# Altium schematic sheet CLKB_power_regulators.SchDoc
size A4
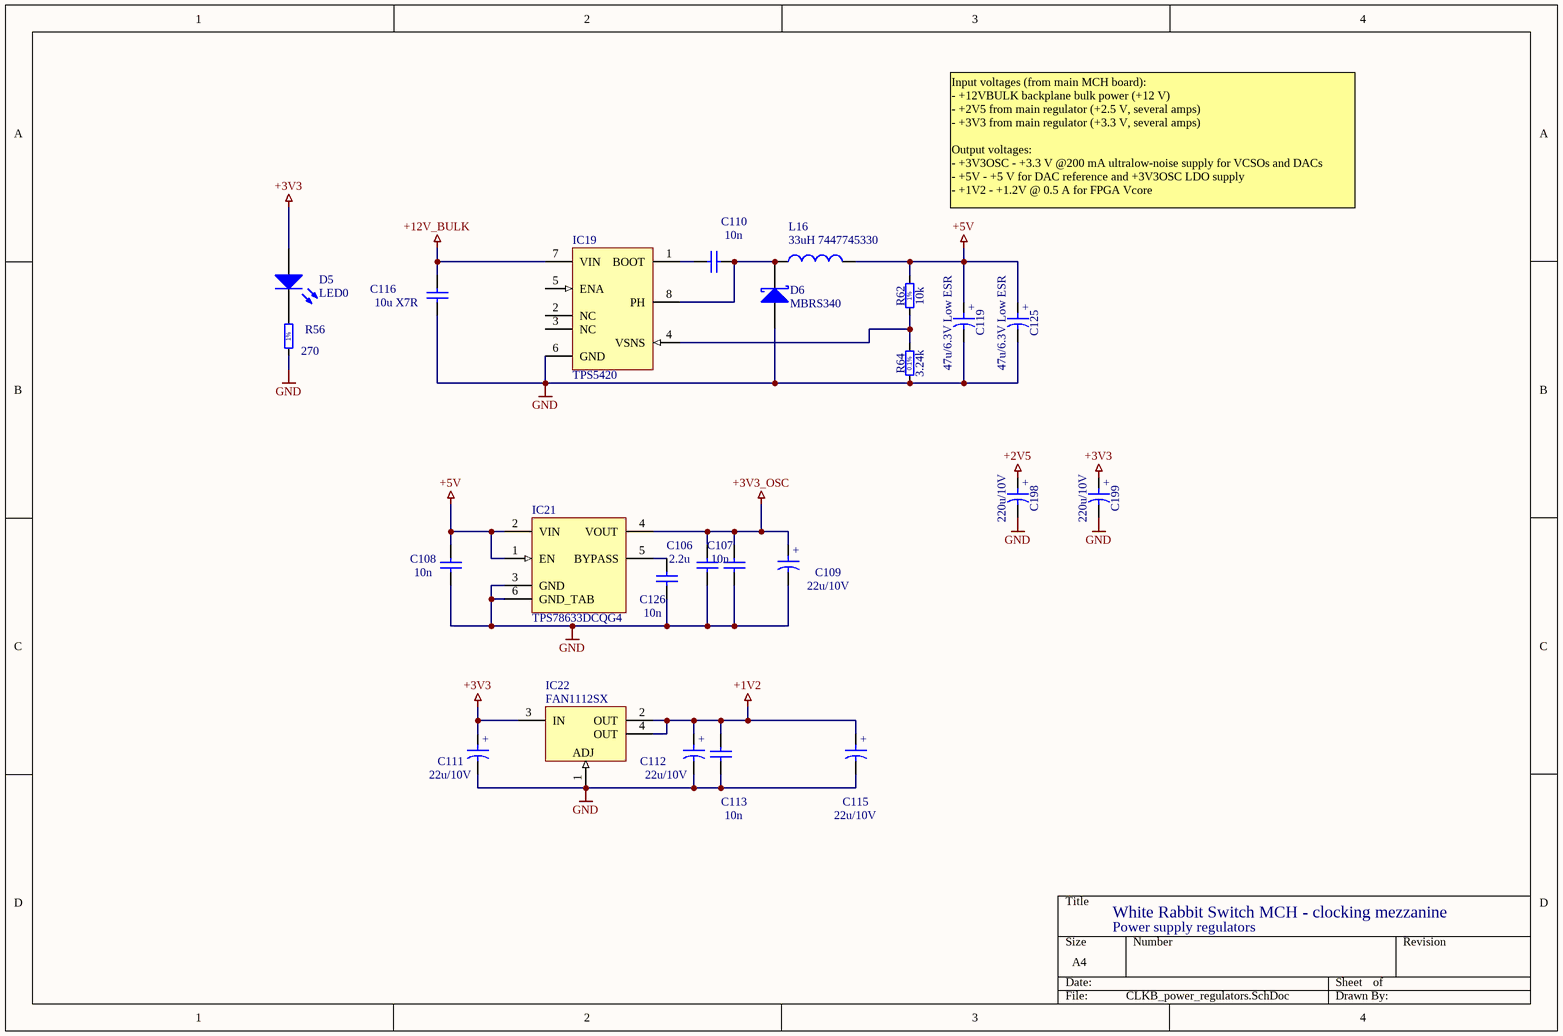
[diagram p0: CLKB_power_regulators.SchDoc]

## Parts
C106  2.2u  [CAPC2012X135N]
C107  10n  [CAPC1608X87N]
C108  10n  [CAPC1608X87N]
C109  22u/10V  [CAPMP3216X180N]
C110  10n  [CAPC1608X87N]
C111  22u/10V  [CAPMP3216X180N]
C112  10n  [CAPC1608X87N]
C113  22u/10V  [CAPMP3216X180N]
C115  22u/10V  [CAPMP3216X180N]
C116  10u X7R  [CAPC3216X140N]
C119  47u/6.3V Low ESR  [CAPMP3528X210N]
C125  47u/6.3V Low ESR  [CAPMP3528X210N]
C126  10n  [CAPC1608X87N]
C198  220u/10V  [CAPMP7343X430N]
C199  220u/10V  [CAPMP7343X430N]
D5  LED0  [CD1608-0603]
D6  MBRS340  [SMB]
IC19  TPS5420  [SOIC127P600-8AL]
IC21  value TPS78633DCQG4  [SOT223-6L]  (hidden comment: TPS78633)
IC22  FAN1112SX  [SOT223-4L]
L16  33uH 7447745330  [L_VLCF5020]
R56  270  [RESC1608X55N]
R62  10k  [RESC1608X55N]
R64  3.24k  [RESC1608X55N]

## Nets
+1V2: C112.2 C113.1 C115.1 IC22.2(OUT) IC22.4(OUT)
+2V5: C198.1
+3V3: C111.1 C199.1 D5.1(A) IC22.3(IN)
+3V3_OSC: C106.2 C107.2 C109.1 IC21.4(VOUT)
+5V: C108.2 C119.1 C125.1 IC21.1(EN) IC21.2(VIN) L16.2 R62.2
+12V_BULK: C116.2 IC19.7(VIN)
GND: C106.1 C107.1 C108.1 C109.2 C111.2 C112.1 C113.2 C115.2 C116.1 C119.2 C125.2 C126.1 C198.2 C199.2 D6.1(A) IC19.6(GND) IC21.3(GND) IC21.6(GND_TAB) IC22.1(ADJ) R56.1 R64.1
NetC110_1: C110.1 D6.2(K) IC19.8(PH) L16.1
NetC110_2: C110.2 IC19.1(BOOT)
NetC126_2: C126.2 IC21.5(BYPASS)
NetD5_2: D5.2(K) R56.2
NetIC19_4: IC19.4(VSNS) R62.1 R64.2

Not connected (* = marked no-connect by the designer): IC19 2(NC) 3(NC) 5(ENA)

## Notes on the sheet
- Input voltages (from main MCH board):
  - +12VBULK backplane bulk power (+12 V)
  - +2V5 from main regulator (+2.5 V, several amps)
  - +3V3 from main regulator (+3.3 V, several amps)
  Output voltages:
  - +3V3OSC - +3.3 V @200 mA ultralow-noise supply for VCSOs and DACs
  - +5V - +5 V for DAC reference and +3V3OSC LDO supply
  - +1V2 - +1.2V @ 0.5 A for FPGA Vcore
- White Rabbit Switch MCH - clocking mezzanine
- Power supply regulators
- (in symbol CTE3216-18_22UF_10V_10%) +
- (in symbol CTE3528-21_47UF_6.3V_10%_LESR0250) +
- (in symbol CTE7343-43_220UF_10V_10%_LESR0050) +
- (in symbol R0603_3K24_0.1%_0.063W_10PPM) 0.1%
- (in symbol R0603_10K_1%_0.1W_100PPM) 1%
- (in symbol R0603_270R_1%_0.1W_100PPM) 1%

## Library data of the parts
C106 = CC0805_2.2UF_16V_10%_X7R: Non-polarised capacitor; Part Description: SMD Multilayer Chip Ceramic Capacitor; Manufacturer: GENERIC; Manufacturer1 Part Number: GRM21BF51C225ZA01L; Manufacturer1 Datasheet: \\cern.ch\dfs\Applications\Altium\Datasheets\CC0805_X7R_KEMET.pdf; Value: 2.2uF; Voltage: 16V; TC: X7R; Tolerance: ±10%; Table: Capacitors SMD; Part Number: CC0805_2.2UF_16V_10%_X7R; Component Kind: Standard; Component Type: Standard; Designator: Capacitor - non polarized; Library Reference: Capacitor - non polarized; Pin Count: 2; Status: Preferred; Manufacturer Part Number: CC0805_2.2UF_16V_10%_X7R; Case: 0805; Mounted: Yes; Socket: No; SMD: Yes; Manufacturer1 Example: MURATA; Manufacturer1 ComponentHeight: 1.5mm; HelpURL: \\cern.ch\dfs\Applications\Altium\Datasheets\CC0805_X7R_KEMET.pdf; Author: CERN DEM JLC; CreateDate: 12/3/2007; LatestRevisionDate: 12/3/2007
C107 C108 C110 C112 C126 = CC0603_10NF_50V_10%_X7R: Non-polarised capacitor; Part Description: SMD Multilayer Chip Ceramic Capacitor; Manufacturer: GENERIC; Manufacturer1 Part Number: 223858615636; Manufacturer1 Datasheet: \\cern.ch\dfs\Applications\Altium\Datasheets\CC0603_X7R_PHYCOMP.pdf; Value: 10nF; Voltage: 50V; TC: X7R; Tolerance: ±10%; Table: Capacitors SMD; Part Number: CC0603_10NF_50V_10%_X7R; Component Kind: Standard; Component Type: Standard; Designator: Capacitor - non polarized; Library Reference: Capacitor - non polarized; Pin Count: 2; Status: Preferred; Manufacturer Part Number: CC0603_10NF_50V_10%_X7R; Case: 0603; Mounted: Yes; Socket: No; SMD: Yes; Manufacturer1 Example: PHYCOMP; Manufacturer1 ComponentHeight: 0.87mm; HelpURL: \\cern.ch\dfs\Applications\Altium\Datasheets\CC0603_X7R_PHYCOMP.pdf; Author: CERN DEM JLC; CreateDate: 12/3/2007; LatestRevisionDate: 12/3/2007
C109 C111 C113 C115 = CTE3216-18_22UF_10V_10%: Polarised capacitor; Part Description: Solid Tantalum Chip Capacitor; Manufacturer: GENERIC; Manufacturer1 Part Number: TAJA226K010R; Manufacturer1 Datasheet: \\cern.ch\dfs\Applications\Altium\Datasheets\CTE_AVX_TAJ.pdf; Value: 22uF; Voltage: 10V; Tolerance: ±10%; Table: Capacitors SMD; Part Number: CTE3216-18_22UF_10V_10%; Component Kind: Standard; Component Type: Standard; Designator: Capacitor - polarized; Library Reference: Capacitor - polarized; Pin Count: 2; Status: Preferred; Manufacturer Part Number: CTE3216-18_22UF_10V_10%; Case: A; Mounted: Yes; Socket: No; SMD: Yes; Manufacturer1 Example: AVX; Manufacturer1 ComponentHeight: 1.8mm; HelpURL: \\cern.ch\dfs\Applications\Altium\Datasheets\CTE_AVX_TAJ.pdf; Author: CERN DEM JLC; CreateDate: 12/3/2007; LatestRevisionDate: 12/3/2007
C116 = CC1206_10UF_16V_10%_X7R: Non-polarised capacitor; Part Description: SMD Multilayer Chip Ceramic Capacitor; Manufacturer: GENERIC; Manufacturer1 Part Number: C1206C106K4RAC; Manufacturer1 Datasheet: \\cern.ch\dfs\Applications\Altium\Datasheets\CC1206_X7R_KEMET.pdf; Value: 10uF; Voltage: 16V; Tolerance: ±10%; Table: Capacitors SMD; Part Number: CC1206_10UF_16V_10%_X7R; Component Kind: Standard; Component Type: Standard; Designator: Capacitor - non polarized; Library Reference: Capacitor - non polarized; Pin Count: 2; Status: Preferred; TC: X7R; Manufacturer Part Number: CC1206_10uF_16V_10%_X7R; Case: 1206; Mounted: Yes; Socket: No; SMD: Yes; Manufacturer1 Example: KEMET; Manufacturer1 ComponentHeight: 1.8mm; HelpURL: \\cern.ch\dfs\Applications\Altium\Datasheets\CC1206_X7R_KEMET.pdf; Author: CERN DEM JLC; CreateDate: 2009-04-28; LatestRevisionDate: 2009-04-28
C119 C125 = CTE3528-21_47UF_6.3V_10%_LESR0250: Polarised capacitor; Part Description: Low ESR 0R25 Solid Tantalum Chip Capacitor; Manufacturer: GENERIC; Manufacturer1 Part Number: TPSB476K006R0250; Manufacturer1 Datasheet: \\cern.ch\dfs\Applications\Altium\Datasheets\CTE-LESR_AVX_TPS.pdf; Value: 47uF; Voltage: 6.3V; Tolerance: ±10%; Table: Capacitors SMD; Part Number: CTE3528-21_47UF_6.3V_10%_LESR0250; Component Kind: Standard; Component Type: Standard; Designator: Capacitor - polarized; Library Reference: Capacitor - polarized; Pin Count: 2; Status: Preferred; Manufacturer Part Number: CTE3528-21_47UF_6.3V_10%_LESR0250; Case: B; Mounted: Yes; Socket: No; SMD: Yes; Manufacturer1 Example: AVX; Manufacturer1 ComponentHeight: 2.1mm; HelpURL: \\cern.ch\dfs\Applications\Altium\Datasheets\CTE-LESR_AVX_TPS.pdf; Author: CERN DEM JLC; CreateDate: 2008-05-05; LatestRevisionDate: 2009-01-20
C198 C199 = CTE7343-43_220UF_10V_10%_LESR0050: Polarised capacitor; Part Description: Low ESR 0R05 Solid Tantalum Chip Capacitor; Manufacturer: GENERIC; Manufacturer1 Part Number: TPSE227K010R0050; Manufacturer1 Datasheet: \\cern.ch\dfs\Applications\Altium\Datasheets\CTE-LESR_AVX_TPS.pdf; Value: 220uF; Voltage: 10V; Tolerance: ±10%; Table: Capacitors SMD; Part Number: CTE7343-43_220UF_10V_10%_LESR0050; Component Kind: Standard; Component Type: Standard; Designator: Capacitor - polarized; Library Reference: Capacitor - polarized; Pin Count: 2; Status: Preferred; Manufacturer Part Number: CTE7343-43_220UF_10V_10%_LESR0050; Case: E; Mounted: Yes; Socket: No; SMD: Yes; Manufacturer1 Example: AVX; Manufacturer1 ComponentHeight: 4.3mm; HelpURL: \\cern.ch\dfs\Applications\Altium\Datasheets\CTE-LESR_AVX_TPS.pdf; Author: CERN DEM JLC; CreateDate: 2008-05-05; LatestRevisionDate: 2009-01-20
D5 = LED0: Red chip LED; Published: 8-Jun-2000; LatestRevisionDate: 08-Jul-2005; LatestRevisionNote: Mech Layer 1 removed.; PackageReference: LED-0; Publisher: Altium Limited
D6 = D Schottky: Schottky Diode; Published: 8-Jun-2000; LatestRevisionDate: 17-Jul-2002; LatestRevisionNote: Re-released for DXP Platform.; PackageReference: SMB; Publisher: Altium Limited; Code_JEDEC: DO-214-AA
IC19 = TPS5420: Step-down switchmode converter
IC21 = TPS786xx: TI low noise LDO, 1A load; RefId: 1207352; Supplier: Farnell
IC22 = 1117: Three-Terminal Adjustable Output Positive Voltage Regulator; Package Information: Latest Revision: 1997; Note: Heatsink surface connected to Pin 2; Code - JEDEC: TO-262-AA; RefId: 1467363; Published: 15-Apr-2002; Datasheet: Latest Revision: 1996; Package Reference: 221A-06; Publisher: Altium Limited; Value: FAN1112SX; Supplier: Farnell
L16 = L_WUERTH_744043: Wuerth small footprint SMD power inductor; Value: 74404300047; Supplier: Mouser; RefId: 74404300047
R56 = R0603_270R_1%_0.1W_100PPM: Resistor - 1%; Part Description: General Purpose Thick Film Chip Resistor; Manufacturer: GENERIC; Manufacturer1 Part Number: NRC06F2700TRF; Manufacturer1 Datasheet: \\cern.ch\dfs\Applications\Altium\Datasheets\R0603_NIC_NRC.pdf; Power: 0.1W; TC: ±100ppm/°C; Table: Resistors SMD; Part Number: R0603_270R_1%_0.1W_100PPM; Component Kind: Standard; Component Type: Standard; Designator: Resistor - 1%; Library Reference: Resistor - 1%; Pin Count: 2; Value: 270; Status: Preferred; Tolerance: ±1%; Manufacturer Part Number: R0603_270R_1%_0.1W_100PPM; Case: 0603; Mounted: Yes; Socket: No; SMD: Yes; Manufacturer1 Example: NIC COMPONENT; Manufacturer1 ComponentHeight: 0.55mm; HelpURL: \\cern.ch\dfs\Applications\Altium\Datasheets\R0603_NIC_NRC.pdf; Author: CERN DEM JLC; CreateDate: 12/3/2007; LatestRevisionDate: 3/13/2008
R62 = R0603_10K_1%_0.1W_100PPM: Resistor - 1%; Part Description: General Purpose Thick Film Chip Resistor; Manufacturer: GENERIC; Manufacturer1 Part Number: NRC06F1002TRF; Manufacturer1 Datasheet: \\cern.ch\dfs\Applications\Altium\Datasheets\R0603_NIC_NRC.pdf; Power: 0.1W; TC: ±100ppm/°C; Table: Resistors SMD; Part Number: R0603_10K_1%_0.1W_100PPM; Component Kind: Standard; Component Type: Standard; Designator: Resistor - 1%; Library Reference: Resistor - 1%; Pin Count: 2; Value: 10k; Status: Preferred; Tolerance: ±1%; Manufacturer Part Number: R0603_10K_1%_0.1W_100PPM; Case: 0603; Mounted: Yes; Socket: No; SMD: Yes; Manufacturer1 Example: NIC COMPONENT; Manufacturer1 ComponentHeight: 0.55mm; HelpURL: \\cern.ch\dfs\Applications\Altium\Datasheets\R0603_NIC_NRC.pdf; Author: CERN DEM JLC; CreateDate: 2007-12-03; LatestRevisionDate: 2008-03-13
R64 = R0603_3K24_0.1%_0.063W_10PPM: Resistor - 0.1%; Part Description: Thin Film Chip Resistor; Manufacturer: GENERIC; Manufacturer1 Part Number: RN73C1J3K24BTDF; Manufacturer1 Datasheet: \\cern.ch\dfs\Applications\Altium\Datasheets\R0603_Tyco_RN73.pdf; Value: 3k24; Power: 0.063W; TC: ±10ppm; Table: Resistors SMD; Part Number: R0603_3K24_0.1%_0.063W_10PPM; Component Kind: Standard; Component Type: Standard; Designator: Resistor - 0.1%; Library Reference: Resistor - 0.1%; Pin Count: 2; Status: Not recommended; Tolerance: ±0.1%; Manufacturer Part Number: R0603_3K24_0.1%_0.063W_10PPM; Case: 0603; Mounted: Yes; Socket: No; SMD: Yes; Manufacturer1 Example: TYCO HOLSWORTHY; Manufacturer1 ComponentHeight: 0.5mm; HelpURL: \\cern.ch\dfs\Applications\Altium\Datasheets\R0603_Tyco_RN73.pdf; Author: CERN DEM JLC; CreateDate: 2007-12-03; LatestRevisionDate: 2008-03-13